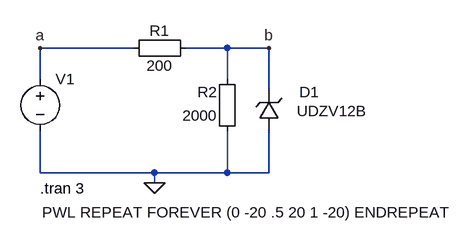
[diagram p0: schematic PL-P1.asc]
PL-P1.asc, the LTspice schematic file:
Version 4
SHEET 1 880 680
WIRE 16 112 -128 112
WIRE 160 112 96 112
WIRE 224 112 160 112
WIRE -128 160 -128 112
WIRE 160 160 160 112
WIRE 224 176 224 112
WIRE -128 304 -128 240
WIRE 48 304 -128 304
WIRE 160 304 160 240
WIRE 160 304 48 304
WIRE 224 304 224 240
WIRE 224 304 160 304
WIRE 48 320 48 304
FLAG -128 112 a
FLAG 224 112 b
FLAG 48 320 0
SYMBOL Misc\\EuropeanResistor 112 96 R90
WINDOW 0 5 56 VBottom 2
WINDOW 3 27 56 VTop 2
SYMATTR InstName R1
SYMATTR Value 200
SYMBOL zener 240 240 R180
WINDOW 0 -62 60 Left 2
WINDOW 3 -135 31 Left 2
SYMATTR InstName D1
SYMATTR Value UDZV12B
SYMATTR Description Diode
SYMATTR Type diode
SYMBOL Misc\\EuropeanResistor 176 256 R180
WINDOW 0 31 76 Left 2
WINDOW 3 31 40 Left 2
SYMATTR InstName R2
SYMATTR Value 2000
SYMBOL voltage -128 144 R0
WINDOW 3 3 221 Left 2
WINDOW 123 0 0 Left 2
WINDOW 39 0 0 Left 2
SYMATTR InstName V1
SYMATTR Value PWL REPEAT FOREVER (0 -20 .5 20 1 -20) ENDREPEAT
TEXT -128 328 Left 2 !.tran 3

The netlist it stands for:
* PL-P1.asc
R1 b a 200
D1 0 b UDZV12B
R2 0 b 2000
V1 a 0 PWL REPEAT FOREVER (0 -20 .5 20 1 -20) ENDREPEAT
.model D D
.lib standard.dio
.tran 3
.backanno
.end